# Altium schematic sheet 04.MCU_PB.SchDoc
size 297 x 209 mm
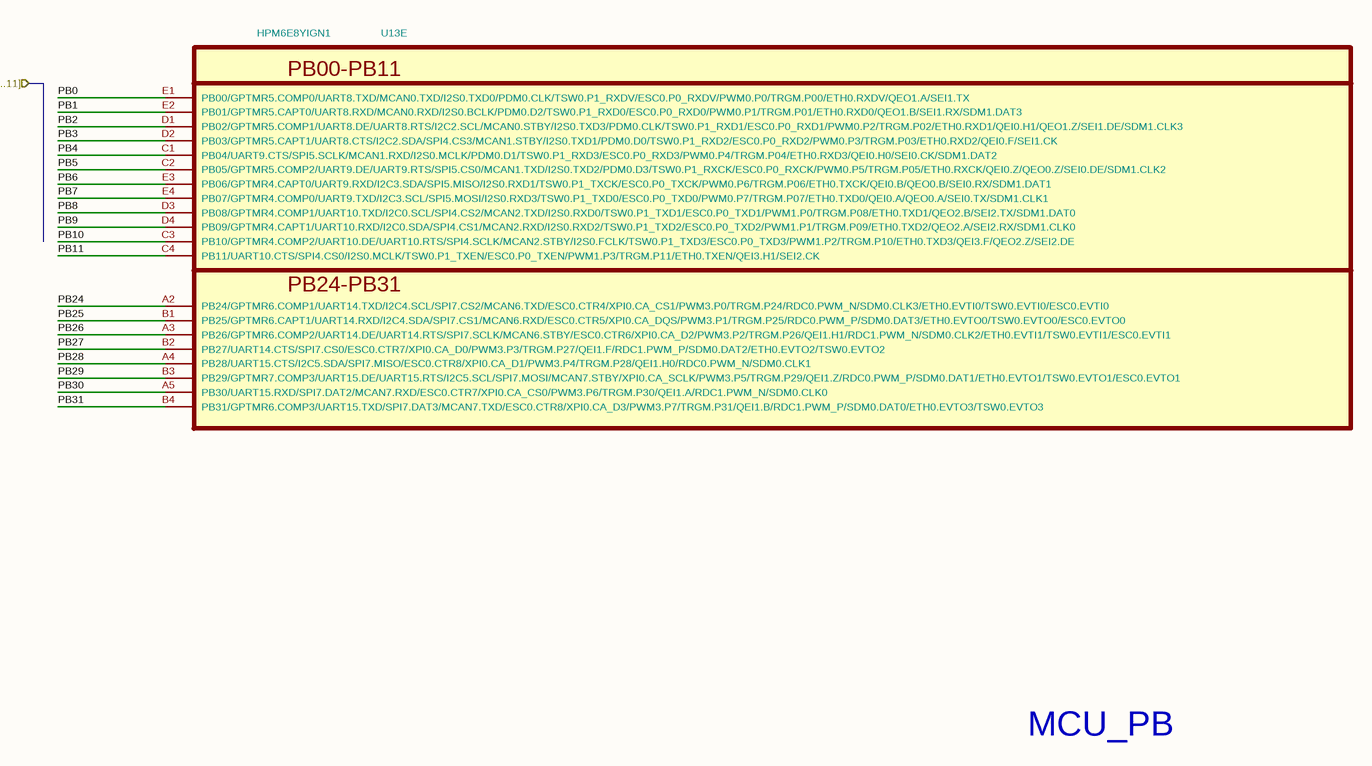
[diagram p0: 04.MCU_PB.SchDoc]

## Parts
U13  HPM6E8YIGN1  [BGA-196_14x14_12.0x12.0mm_P0.8mm]  (part E of 10)

## Ports
PB[0..11] (in)

## Nets
PB0: U13.E1(PB00/GPTMR5.COMP0/UART8.TXD/MCAN0.TXD/I2S0.TXD0/PDM0.CLK/TSW0.P1_RXDV/ESC0.P0_RXDV/PWM0.P0/TRGM.P00/ETH0.RXDV/QEO1.A/SEI1.TX)
PB1: U13.E2(PB01/GPTMR5.CAPT0/UART8.RXD/MCAN0.RXD/I2S0.BCLK/PDM0.D2/TSW0.P1_RXD0/ESC0.P0_RXD0/PWM0.P1/TRGM.P01/ETH0.RXD0/QEO1.B/SEI1.RX/SDM1.DAT3)
PB2: U13.D1(PB02/GPTMR5.COMP1/UART8.DE/UART8.RTS/I2C2.SCL/MCAN0.STBY/I2S0.TXD3/PDM0.CLK/TSW0.P1_RXD1/ESC0.P0_RXD1/PWM0.P2/TRGM.P02/ETH0.RXD1/QEI0.H1/QEO1.Z/SEI1.DE/SDM1.CLK3)
PB3: U13.D2(PB03/GPTMR5.CAPT1/UART8.CTS/I2C2.SDA/SPI4.CS3/MCAN1.STBY/I2S0.TXD1/PDM0.D0/TSW0.P1_RXD2/ESC0.P0_RXD2/PWM0.P3/TRGM.P03/ETH0.RXD2/QEI0.F/SEI1.CK)
PB4: U13.C1(PB04/UART9.CTS/SPI5.SCLK/MCAN1.RXD/I2S0.MCLK/PDM0.D1/TSW0.P1_RXD3/ESC0.P0_RXD3/PWM0.P4/TRGM.P04/ETH0.RXD3/QEI0.H0/SEI0.CK/SDM1.DAT2)
PB5: U13.C2(PB05/GPTMR5.COMP2/UART9.DE/UART9.RTS/SPI5.CS0/MCAN1.TXD/I2S0.TXD2/PDM0.D3/TSW0.P1_RXCK/ESC0.P0_RXCK/PWM0.P5/TRGM.P05/ETH0.RXCK/QEI0.Z/QEO0.Z/SEI0.DE/SDM1.CLK2)
PB6: U13.E3(PB06/GPTMR4.CAPT0/UART9.RXD/I2C3.SDA/SPI5.MISO/I2S0.RXD1/TSW0.P1_TXCK/ESC0.P0_TXCK/PWM0.P6/TRGM.P06/ETH0.TXCK/QEI0.B/QEO0.B/SEI0.RX/SDM1.DAT1)
PB7: U13.E4(PB07/GPTMR4.COMP0/UART9.TXD/I2C3.SCL/SPI5.MOSI/I2S0.RXD3/TSW0.P1_TXD0/ESC0.P0_TXD0/PWM0.P7/TRGM.P07/ETH0.TXD0/QEI0.A/QEO0.A/SEI0.TX/SDM1.CLK1)
PB8: U13.D3(PB08/GPTMR4.COMP1/UART10.TXD/I2C0.SCL/SPI4.CS2/MCAN2.TXD/I2S0.RXD0/TSW0.P1_TXD1/ESC0.P0_TXD1/PWM1.P0/TRGM.P08/ETH0.TXD1/QEO2.B/SEI2.TX/SDM1.DAT0)
PB9: U13.D4(PB09/GPTMR4.CAPT1/UART10.RXD/I2C0.SDA/SPI4.CS1/MCAN2.RXD/I2S0.RXD2/TSW0.P1_TXD2/ESC0.P0_TXD2/PWM1.P1/TRGM.P09/ETH0.TXD2/QEO2.A/SEI2.RX/SDM1.CLK0)
PB10: U13.C3(PB10/GPTMR4.COMP2/UART10.DE/UART10.RTS/SPI4.SCLK/MCAN2.STBY/I2S0.FCLK/TSW0.P1_TXD3/ESC0.P0_TXD3/PWM1.P2/TRGM.P10/ETH0.TXD3/QEI3.F/QEO2.Z/SEI2.DE)
PB11: U13.C4(PB11/UART10.CTS/SPI4.CS0/I2S0.MCLK/TSW0.P1_TXEN/ESC0.P0_TXEN/PWM1.P3/TRGM.P11/ETH0.TXEN/QEI3.H1/SEI2.CK)
PB24: U13.A2(PB24/GPTMR6.COMP1/UART14.TXD/I2C4.SCL/SPI7.CS2/MCAN6.TXD/ESC0.CTR4/XPI0.CA_CS1/PWM3.P0/TRGM.P24/RDC0.PWM_N/SDM0.CLK3/ETH0.EVTI0/TSW0.EVTI0/ESC0.EVTI0)
PB25: U13.B1(PB25/GPTMR6.CAPT1/UART14.RXD/I2C4.SDA/SPI7.CS1/MCAN6.RXD/ESC0.CTR5/XPI0.CA_DQS/PWM3.P1/TRGM.P25/RDC0.PWM_P/SDM0.DAT3/ETH0.EVTO0/TSW0.EVTO0/ESC0.EVTO0)
PB26: U13.A3(PB26/GPTMR6.COMP2/UART14.DE/UART14.RTS/SPI7.SCLK/MCAN6.STBY/ESC0.CTR6/XPI0.CA_D2/PWM3.P2/TRGM.P26/QEI1.H1/RDC1.PWM_N/SDM0.CLK2/ETH0.EVTI1/TSW0.EVTI1/ESC0.EVTI1)
PB27: U13.B2(PB27/UART14.CTS/SPI7.CS0/ESC0.CTR7/XPI0.CA_D0/PWM3.P3/TRGM.P27/QEI1.F/RDC1.PWM_P/SDM0.DAT2/ETH0.EVTO2/TSW0.EVTO2)
PB28: U13.A4(PB28/UART15.CTS/I2C5.SDA/SPI7.MISO/ESC0.CTR8/XPI0.CA_D1/PWM3.P4/TRGM.P28/QEI1.H0/RDC0.PWM_N/SDM0.CLK1)
PB29: U13.B3(PB29/GPTMR7.COMP3/UART15.DE/UART15.RTS/I2C5.SCL/SPI7.MOSI/MCAN7.STBY/XPI0.CA_SCLK/PWM3.P5/TRGM.P29/QEI1.Z/RDC0.PWM_P/SDM0.DAT1/ETH0.EVTO1/TSW0.EVTO1/ESC0.EVTO1)
PB30: U13.A5(PB30/UART15.RXD/SPI7.DAT2/MCAN7.RXD/ESC0.CTR7/XPI0.CA_CS0/PWM3.P6/TRGM.P30/QEI1.A/RDC1.PWM_N/SDM0.CLK0)
PB31: U13.B4(PB31/GPTMR6.COMP3/UART15.TXD/SPI7.DAT3/MCAN7.TXD/ESC0.CTR8/XPI0.CA_D3/PWM3.P7/TRGM.P31/QEI1.B/RDC1.PWM_P/SDM0.DAT0/ETH0.EVTO3/TSW0.EVTO3)

## Notes on the sheet
- MCU_PB
- 1
- 2
- 3
- 4
- 5
- 6
- A
- B
- C
- D
- Title: HPM6E8Y_RbMotor_ECAT
- File: 04.MCU_PB.kicad_sch
- Sheet: /
- KiCad E.D.A.  kicad (5.1.4)-1
- Size: A4
- Date: 2023-12-28
- Rev: RevB+
- Id: 1/1
- (in symbol HPM6E8YIGN1, part E) PB00-PB11; PB24-PB31

## Library data of the parts
U13 = HPM6E8YIGN1: Value: HPM6E8YIGN1; Footprint: 00_HPM_Library:BGA-196_14x14_12.0x12.0mm_P0.8mm